# Altium schematic sheet led.SchDoc
size A3
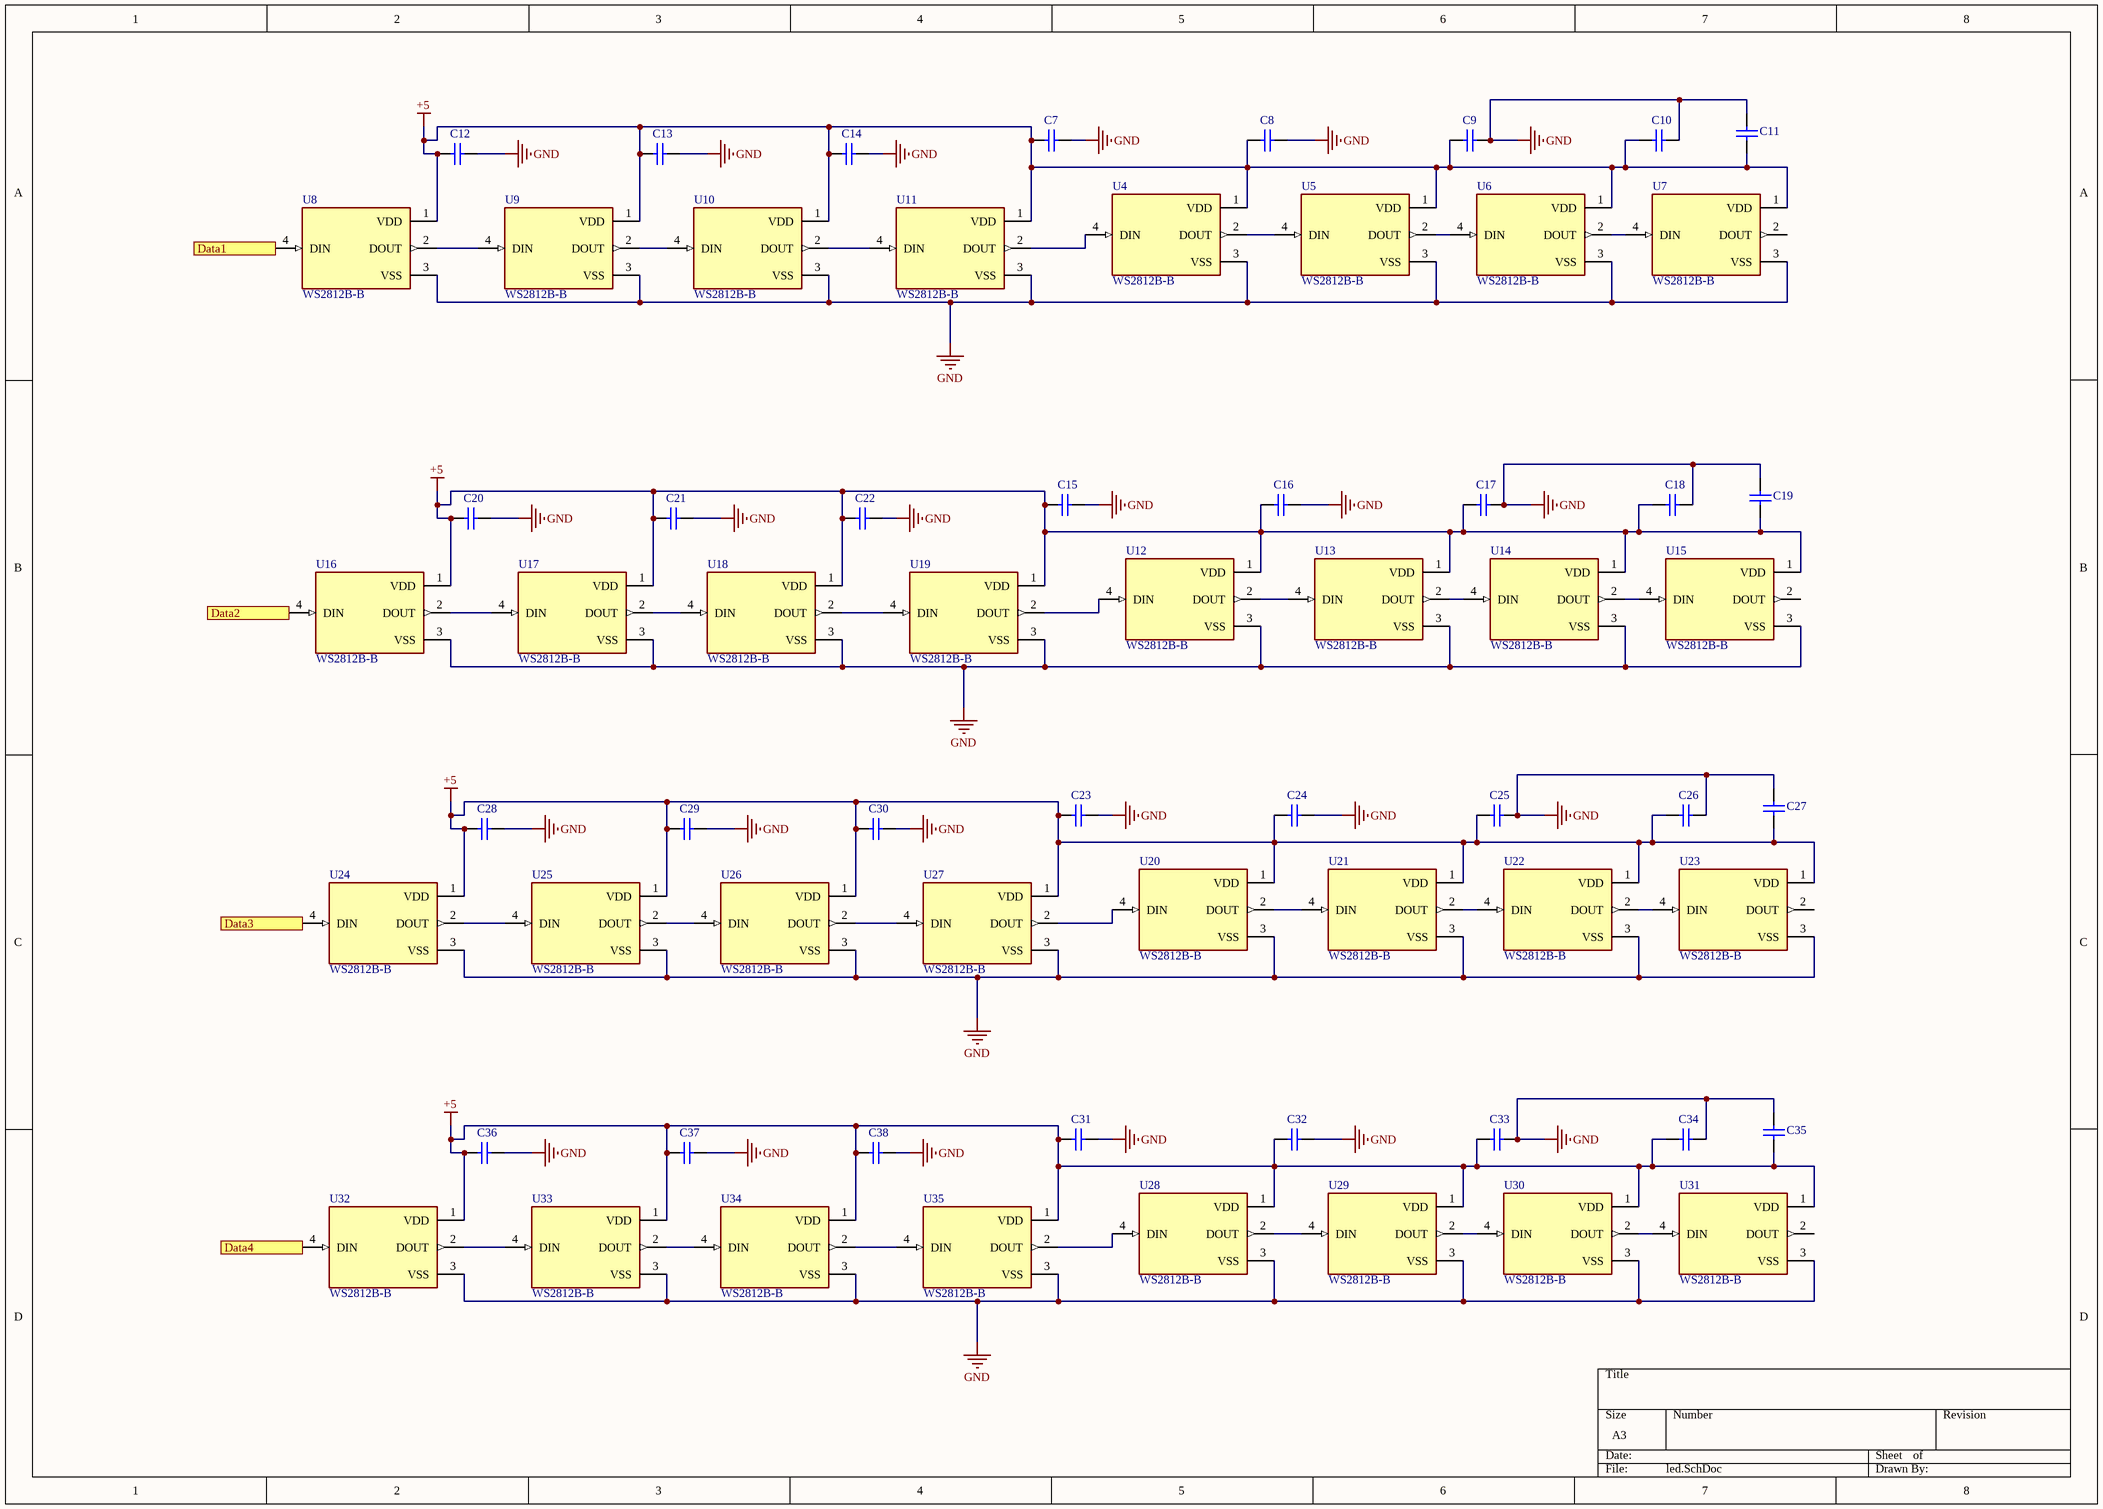
[diagram p0: led.SchDoc]

## Parts
C7  Capacitor Ceramic  [C0805]  (value not drawn)
C8  Capacitor Ceramic  [C0805]  (value not drawn)
C9  Capacitor Ceramic  [C0805]  (value not drawn)
C10  Capacitor Ceramic  [C0805]  (value not drawn)
C11  Capacitor Ceramic  [C0805]  (value not drawn)
C12  Capacitor Ceramic  [C0805]  (value not drawn)
C13  Capacitor Ceramic  [C0805]  (value not drawn)
C14  Capacitor Ceramic  [C0805]  (value not drawn)
C15  Capacitor Ceramic  [C0805]  (value not drawn)
C16  Capacitor Ceramic  [C0805]  (value not drawn)
C17  Capacitor Ceramic  [C0805]  (value not drawn)
C18  Capacitor Ceramic  [C0805]  (value not drawn)
C19  Capacitor Ceramic  [C0805]  (value not drawn)
C20  Capacitor Ceramic  [C0805]  (value not drawn)
C21  Capacitor Ceramic  [C0805]  (value not drawn)
C22  Capacitor Ceramic  [C0805]  (value not drawn)
C23  Capacitor Ceramic  [C0805]  (value not drawn)
C24  Capacitor Ceramic  [C0805]  (value not drawn)
C25  Capacitor Ceramic  [C0805]  (value not drawn)
C26  Capacitor Ceramic  [C0805]  (value not drawn)
C27  Capacitor Ceramic  [C0805]  (value not drawn)
C28  Capacitor Ceramic  [C0805]  (value not drawn)
C29  Capacitor Ceramic  [C0805]  (value not drawn)
C30  Capacitor Ceramic  [C0805]  (value not drawn)
C31  Capacitor Ceramic  [C0805]  (value not drawn)
C32  Capacitor Ceramic  [C0805]  (value not drawn)
C33  Capacitor Ceramic  [C0805]  (value not drawn)
C34  Capacitor Ceramic  [C0805]  (value not drawn)
C35  Capacitor Ceramic  [C0805]  (value not drawn)
C36  Capacitor Ceramic  [C0805]  (value not drawn)
C37  Capacitor Ceramic  [C0805]  (value not drawn)
C38  Capacitor Ceramic  [C0805]  (value not drawn)
U4  WS2812B-B  [LED_WS2812B-B]
U5  WS2812B-B  [LED_WS2812B-B]
U6  WS2812B-B  [LED_WS2812B-B]
U7  WS2812B-B  [LED_WS2812B-B]
U8  WS2812B-B  [LED_WS2812B-B]
U9  WS2812B-B  [LED_WS2812B-B]
U10  WS2812B-B  [LED_WS2812B-B]
U11  WS2812B-B  [LED_WS2812B-B]
U12  WS2812B-B  [LED_WS2812B-B]
U13  WS2812B-B  [LED_WS2812B-B]
U14  WS2812B-B  [LED_WS2812B-B]
U15  WS2812B-B  [LED_WS2812B-B]
U16  WS2812B-B  [LED_WS2812B-B]
U17  WS2812B-B  [LED_WS2812B-B]
U18  WS2812B-B  [LED_WS2812B-B]
U19  WS2812B-B  [LED_WS2812B-B]
U20  WS2812B-B  [LED_WS2812B-B]
U21  WS2812B-B  [LED_WS2812B-B]
U22  WS2812B-B  [LED_WS2812B-B]
U23  WS2812B-B  [LED_WS2812B-B]
U24  WS2812B-B  [LED_WS2812B-B]
U25  WS2812B-B  [LED_WS2812B-B]
U26  WS2812B-B  [LED_WS2812B-B]
U27  WS2812B-B  [LED_WS2812B-B]
U28  WS2812B-B  [LED_WS2812B-B]
U29  WS2812B-B  [LED_WS2812B-B]
U30  WS2812B-B  [LED_WS2812B-B]
U31  WS2812B-B  [LED_WS2812B-B]
U32  WS2812B-B  [LED_WS2812B-B]
U33  WS2812B-B  [LED_WS2812B-B]
U34  WS2812B-B  [LED_WS2812B-B]
U35  WS2812B-B  [LED_WS2812B-B]

## Ports
Data1, Data2, Data3, Data4

## Nets
+5: C7.1 C8.1 C9.1 C10.1 C11.1 C12.1 C13.1 C14.1 C15.1 C16.1 C17.1 C18.1 C19.1 C20.1 C21.1 C22.1 C23.1 C24.1 C25.1 C26.1 C27.1 C28.1 C29.1 C30.1 C31.1 C32.1 C33.1 C34.1 C35.1 C36.1 C37.1 C38.1 U4.1(VDD) U5.1(VDD) U6.1(VDD) U7.1(VDD) U8.1(VDD) U9.1(VDD) U10.1(VDD) U11.1(VDD) U12.1(VDD) U13.1(VDD) U14.1(VDD) U15.1(VDD) U16.1(VDD) U17.1(VDD) U18.1(VDD) U19.1(VDD) U20.1(VDD) U21.1(VDD) U22.1(VDD) U23.1(VDD) U24.1(VDD) U25.1(VDD) U26.1(VDD) U27.1(VDD) U28.1(VDD) U29.1(VDD) U30.1(VDD) U31.1(VDD) U32.1(VDD) U33.1(VDD) U34.1(VDD) U35.1(VDD)
GND: C7.2 C8.2 C9.2 C10.2 C11.2 C12.2 C13.2 C14.2 C15.2 C16.2 C17.2 C18.2 C19.2 C20.2 C21.2 C22.2 C23.2 C24.2 C25.2 C26.2 C27.2 C28.2 C29.2 C30.2 C31.2 C32.2 C33.2 C34.2 C35.2 C36.2 C37.2 C38.2 U4.3(VSS) U5.3(VSS) U6.3(VSS) U7.3(VSS) U8.3(VSS) U9.3(VSS) U10.3(VSS) U11.3(VSS) U12.3(VSS) U13.3(VSS) U14.3(VSS) U15.3(VSS) U16.3(VSS) U17.3(VSS) U18.3(VSS) U19.3(VSS) U20.3(VSS) U21.3(VSS) U22.3(VSS) U23.3(VSS) U24.3(VSS) U25.3(VSS) U26.3(VSS) U27.3(VSS) U28.3(VSS) U29.3(VSS) U30.3(VSS) U31.3(VSS) U32.3(VSS) U33.3(VSS) U34.3(VSS) U35.3(VSS)
Data1: U8.4(DIN) ; port Data1
Data2: U16.4(DIN) ; port Data2
Data3: U24.4(DIN) ; port Data3
Data4: U32.4(DIN) ; port Data4
NetU4_2: U4.2(DOUT) U5.4(DIN)
NetU4_4: U4.4(DIN) U11.2(DOUT)
NetU5_2: U5.2(DOUT) U6.4(DIN)
NetU6_2: U6.2(DOUT) U7.4(DIN)
NetU8_2: U8.2(DOUT) U9.4(DIN)
NetU9_2: U9.2(DOUT) U10.4(DIN)
NetU10_2: U10.2(DOUT) U11.4(DIN)
NetU12_2: U12.2(DOUT) U13.4(DIN)
NetU12_4: U12.4(DIN) U19.2(DOUT)
NetU13_2: U13.2(DOUT) U14.4(DIN)
NetU14_2: U14.2(DOUT) U15.4(DIN)
NetU16_2: U16.2(DOUT) U17.4(DIN)
NetU17_2: U17.2(DOUT) U18.4(DIN)
NetU18_2: U18.2(DOUT) U19.4(DIN)
NetU20_2: U20.2(DOUT) U21.4(DIN)
NetU20_4: U20.4(DIN) U27.2(DOUT)
NetU21_2: U21.2(DOUT) U22.4(DIN)
NetU22_2: U22.2(DOUT) U23.4(DIN)
NetU24_2: U24.2(DOUT) U25.4(DIN)
NetU25_2: U25.2(DOUT) U26.4(DIN)
NetU26_2: U26.2(DOUT) U27.4(DIN)
NetU28_2: U28.2(DOUT) U29.4(DIN)
NetU28_4: U28.4(DIN) U35.2(DOUT)
NetU29_2: U29.2(DOUT) U30.4(DIN)
NetU30_2: U30.2(DOUT) U31.4(DIN)
NetU32_2: U32.2(DOUT) U33.4(DIN)
NetU33_2: U33.2(DOUT) U34.4(DIN)
NetU34_2: U34.2(DOUT) U35.4(DIN)

Not connected (* = marked no-connect by the designer): U7 2(DOUT); U15 2(DOUT); U23 2(DOUT); U31 2(DOUT)

## Library data of the parts
C7-C38 = CapSMD: Capacitor; Value: 33p; Published: 8-Jun-2000; LatestRevisionDate: 17-Jul-2002; LatestRevisionNote: Re-released for DXP Platform.; PackageReference: RAD-0.3; Publisher: Altium Limited
U4-U35 = WS2812B-B: Intelligent control LED integrated light source; Availability: Unavailable; Price: None; Package: None; MP: WS2812B-B; Value: *